# EAGLE schematic V-00795-00 (EAGLE 7.2.0)
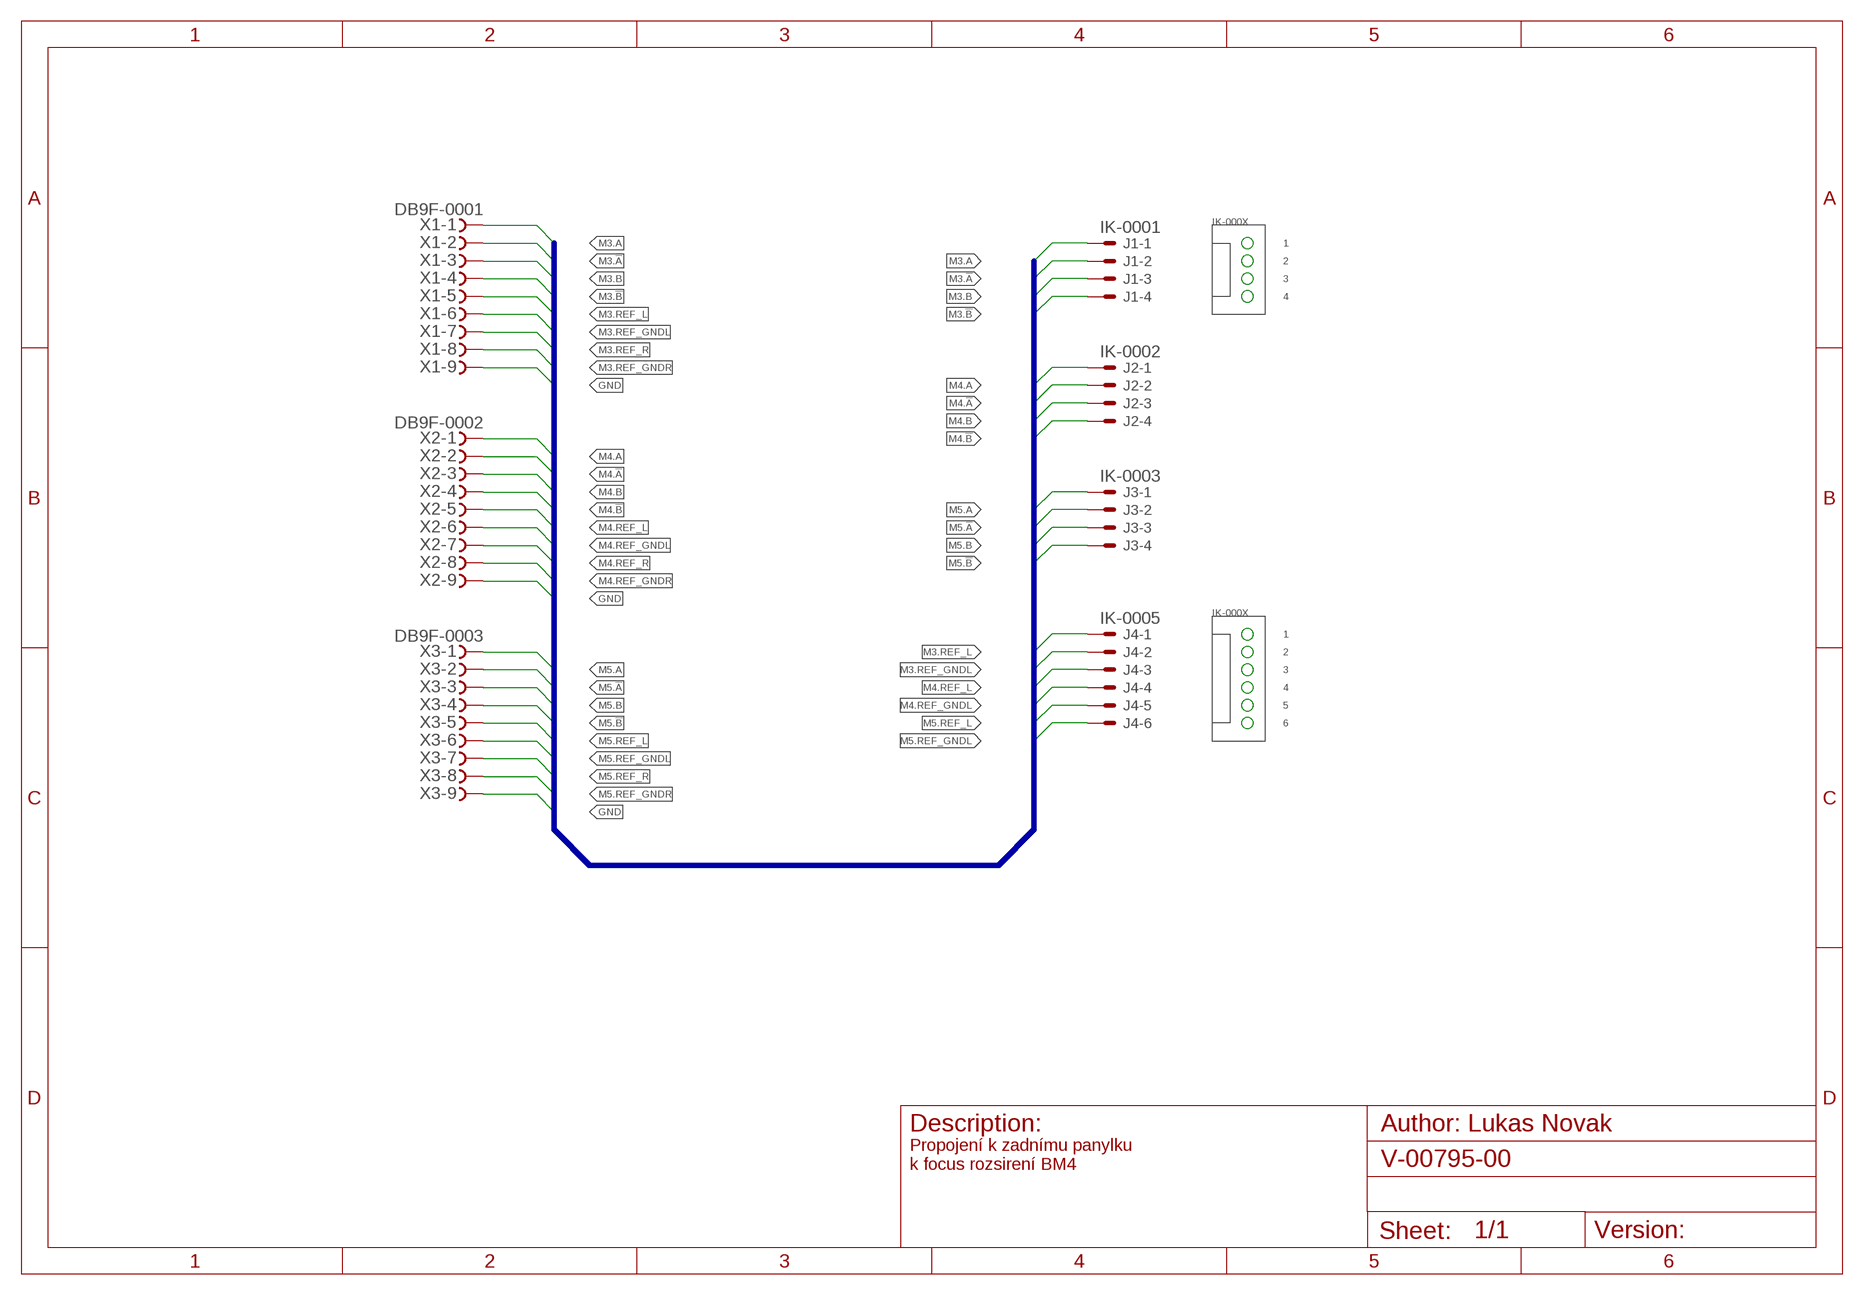
[diagram p0: schematic, sheet 1]

## Parts
J1  IK-0001  22-27-2041-04  [6410-04]
J2  IK-0002  22-27-2041-04  [6410-04]
J3  IK-0003  22-27-2041-04  [6410-04]
J4  IK-0005  22-27-2061-06  [6410-06]
X1  DB9F-0001  D-SUB9-H2M09ST  [H2M09ST]
X2  DB9F-0002  D-SUB9-H2M09ST  [H2M09ST]
X3  DB9F-0003  D-SUB9-H2M09ST  [H2M09ST]

## Nets
GND: X1.9 X2.9 X3.9
M3.!A: J1.2 X1.2
M3.!B: J1.4 X1.4
M3.A: J1.1 X1.1
M3.B: J1.3 X1.3
M3.REF_GNDL: J4.2 X1.6
M3.REF_GNDR: X1.8
M3.REF_L: J4.1 X1.5
M3.REF_R: X1.7
M4.!A: J2.2 X2.2
M4.!B: J2.4 X2.4
M4.A: J2.1 X2.1
M4.B: J2.3 X2.3
M4.REF_GNDL: J4.4 X2.6
M4.REF_GNDR: X2.8
M4.REF_L: J4.3 X2.5
M4.REF_R: X2.7
M5.!A: J3.2 X3.2
M5.!B: J3.4 X3.4
M5.A: J3.1 X3.1
M5.B: J3.3 X3.3
M5.REF_GNDL: J4.6 X3.6
M5.REF_GNDR: X3.8
M5.REF_L: J4.5 X3.5
M5.REF_R: X3.7

## Buses
M3.A,M3.!A,M3.B,M3.!B,M3.REF_L,M3.REF_GNDL,M3.REF_R,M3.REF_GNDR,GND,M4.A,M4.!A,M4.B,M4.!B,M4.REF_L,M4.REF_GNDL,M4.REF_R,M4.REF_GNDR,M5.A,M5.!A,M5.B,M5.!B,M5.REF_L,M5.REF_GNDL,M5.REF_R,M5.REF_GNDR

## Notes on the sheet
- IK-000X
- 1
- 2
- 3
- 4
- IK-000X
- 1
- 2
- 3
- 4
- 5
- 6
- Propojení k zadnímu panylku
  k focus rozsirení BM4

## Library data of the parts
J1-J3 = con-molex:22-?-04: CONNECTOR wire to board 2.54 mm (.1 inch) pitch header; OC_FARNELL: unknown; OC_NEWARK: unknown
J4 = con-molex:22-?-06: CONNECTOR wire to board 2.54 mm (.1 inch) pitch header; OC_FARNELL: unknown; OC_NEWARK: unknown
X1-X3 = con-thomas-betts:D-SUB9-: D-Subminiatur Connector Source: Electronioc Interconnects European Edition 1998; OC_FARNELL: unknown; OC_NEWARK: unknown